# Altium schematic sheet Lora_Com.SchDoc
size 594 x 420 mm; CheckedBy: Трухачев И.; Author: Денисов В.; SheetNumber: 1; PageSetup: Record=PageOptions|CenterHorizontal=True|CenterVertical=True|PrintScale=0.94|XCorrection=1.00|YCorrection=1.00|PrintKind=1|BorderSize=5000000|LeftOffset=0|BottomOffset=0|Orientation=1|PaperLength=1000|PaperWidth=1000|Scale=100|PaperSource=7|PrintQuality=-4|MediaType=1|DitherType=10|PaperKind=A4|PrintScaleMode=1; DecimalNumber: ГРКЕ.464421.034 Э3; HeadOfSector: Нач. сектора; MainDevice: Перв.примен.; Name: Изделие-коммуникатор
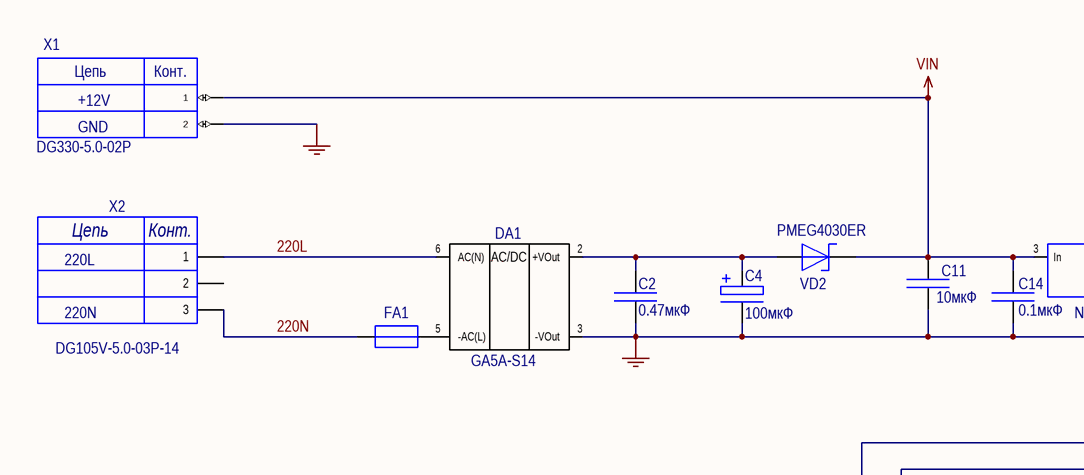
[diagram p0: Lora_Com.SchDoc, top left]
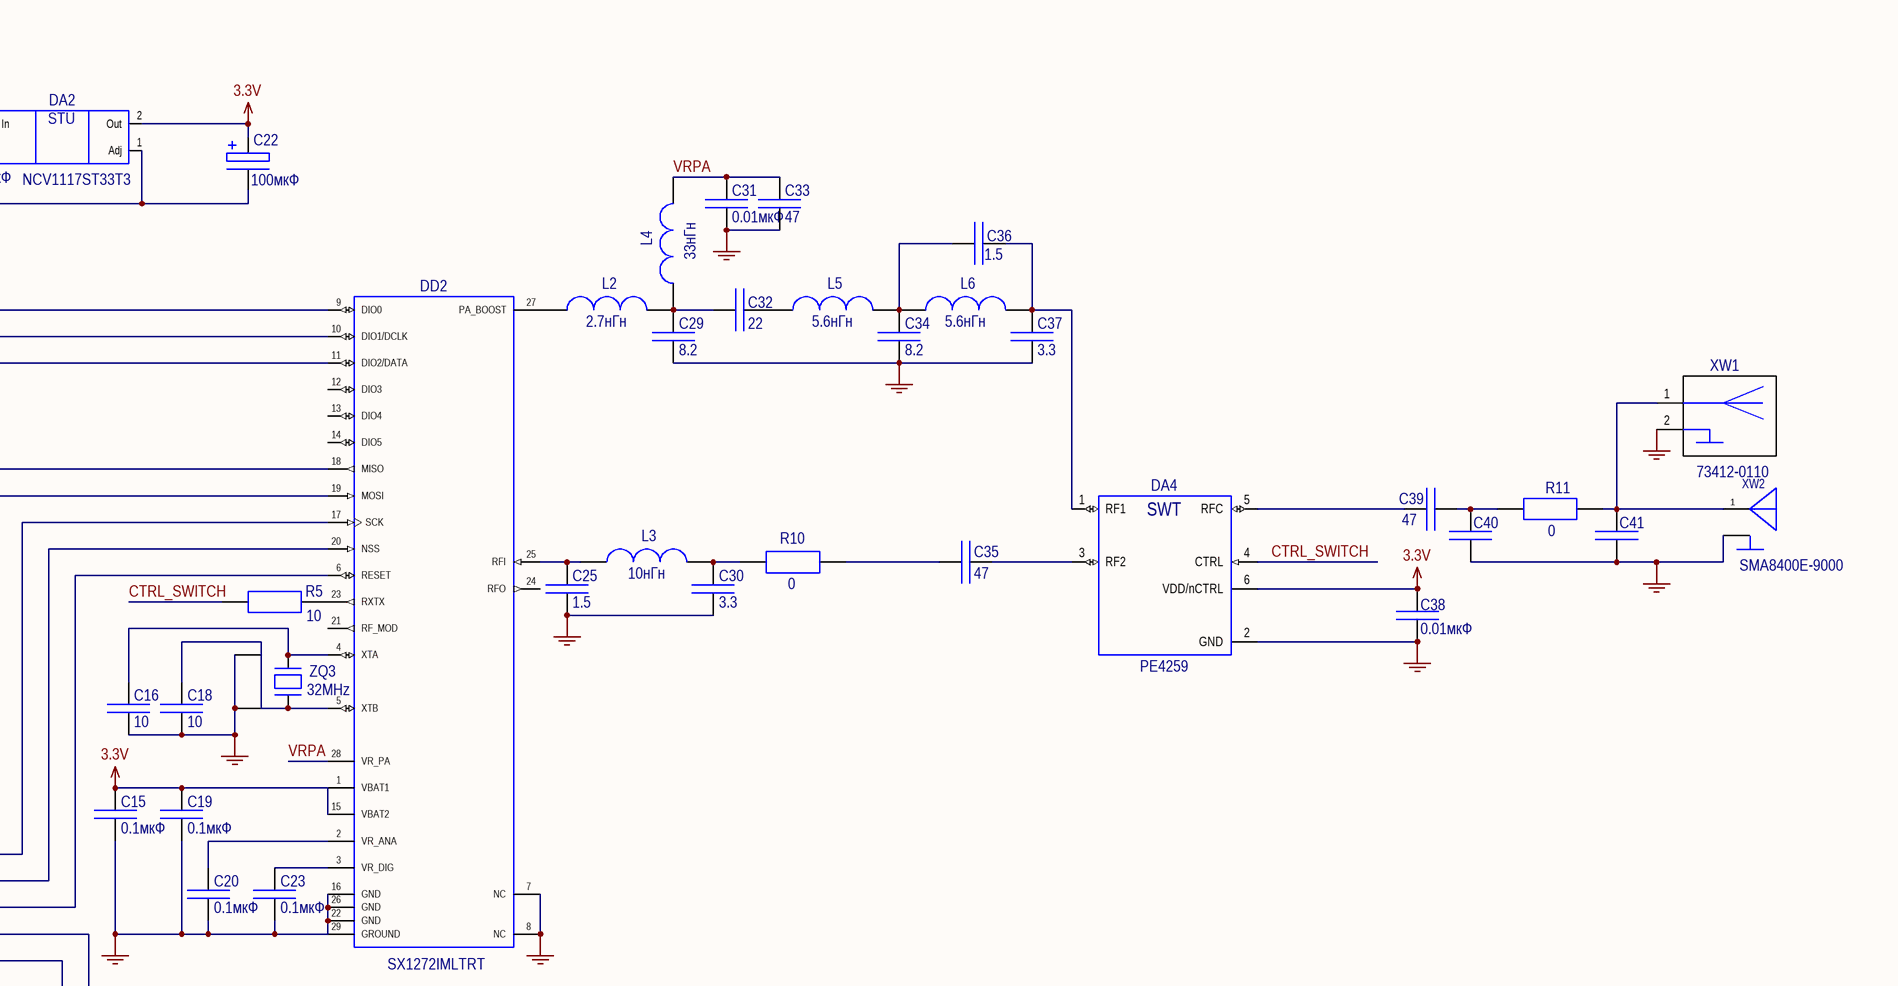
[diagram p1: Lora_Com.SchDoc, top right]
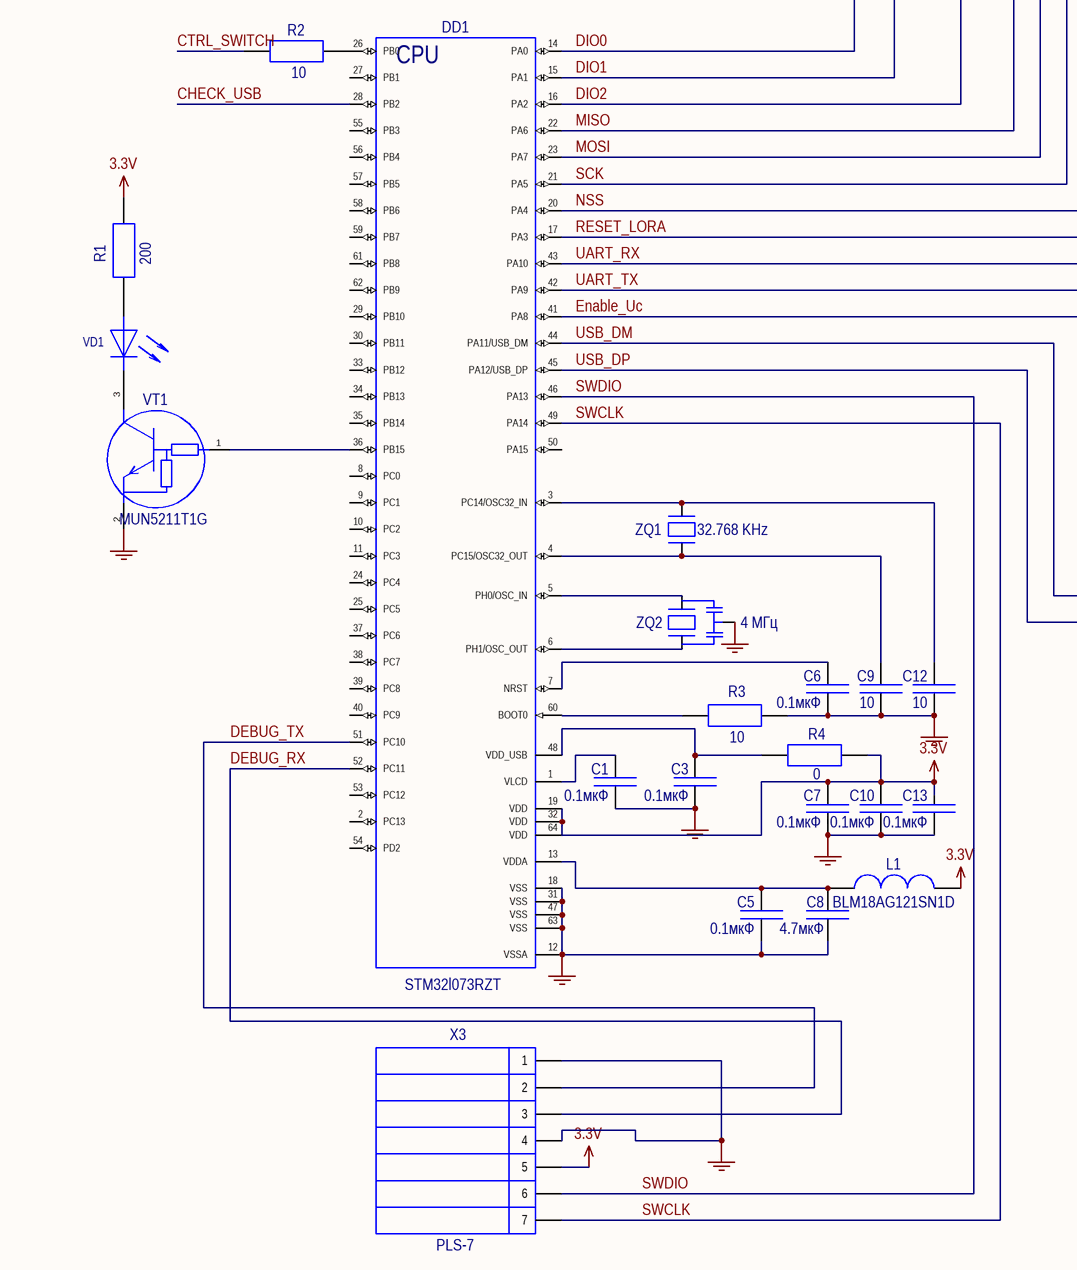
[diagram p2: Lora_Com.SchDoc, bottom left]
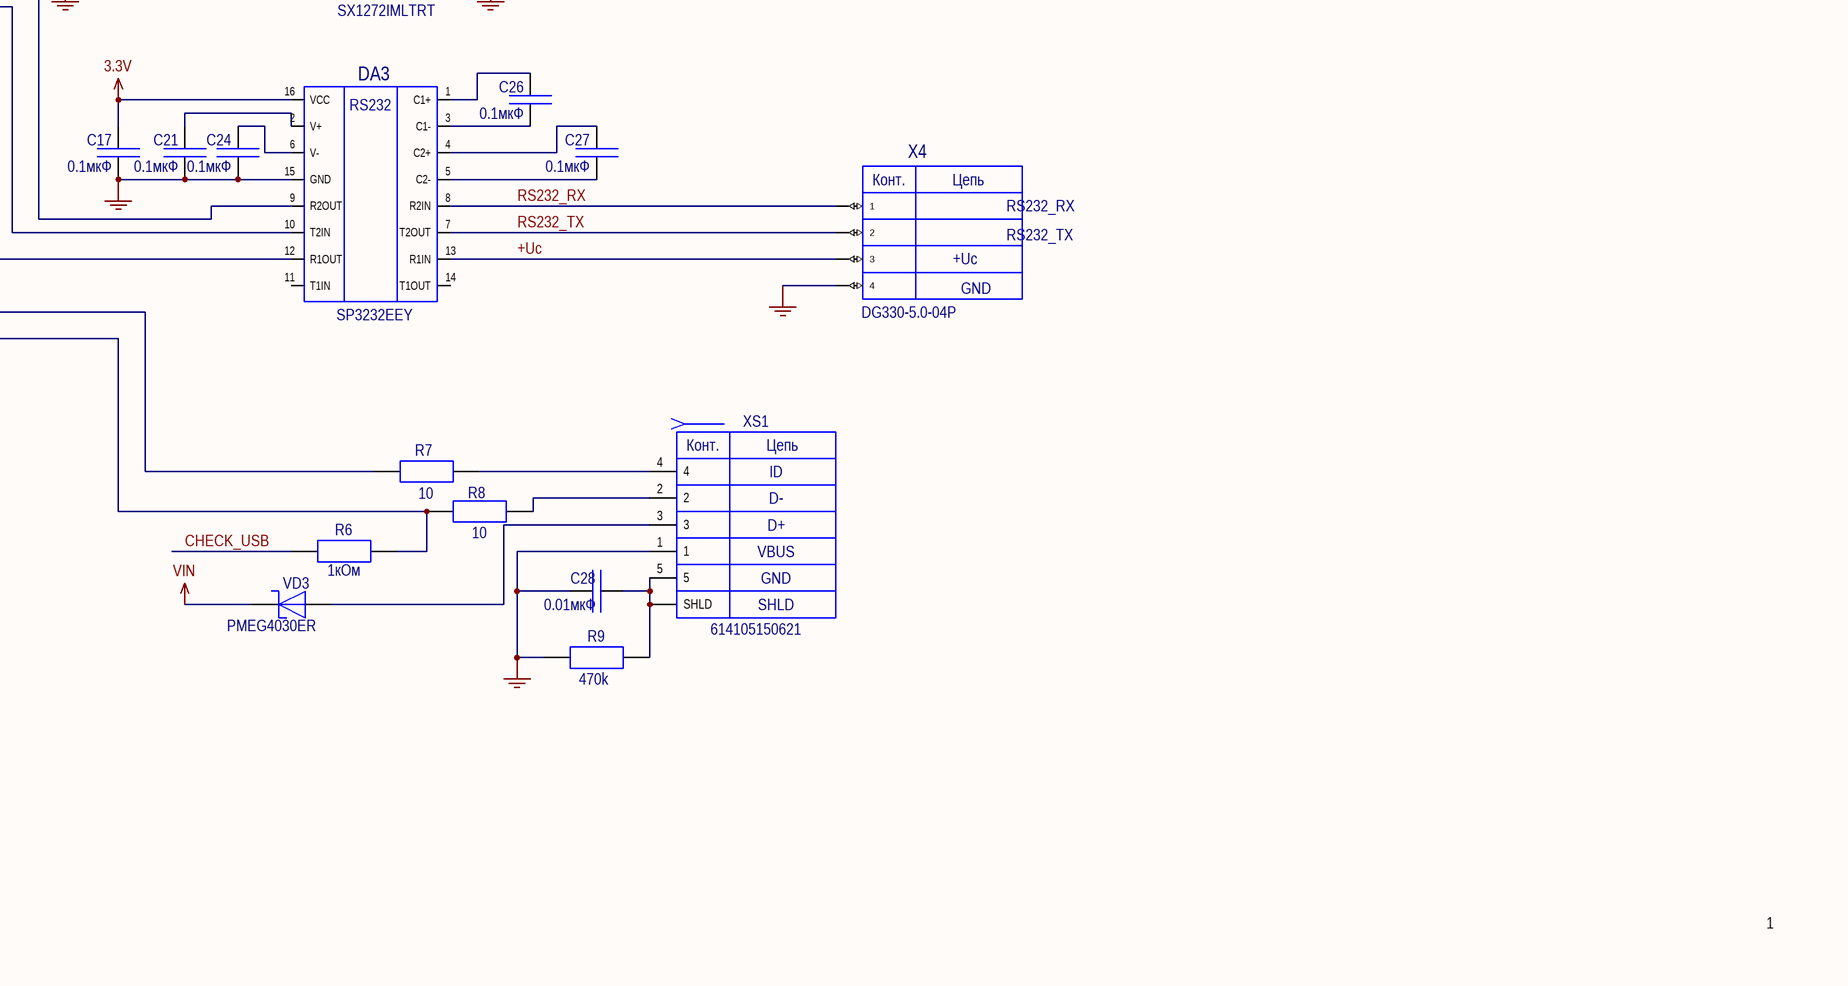
[diagram p3: Lora_Com.SchDoc, bottom right]

## Parts
C1  value 0.1мкФ  [CAPC1005X50(0402)]  (hidden comment: чип 0402 0.1мкФ/10V,)
C2  value 0.47мкФ  [CAPC1608X50(0603)]  (hidden comment: чип 0603 0.47мкФ/25V,)
C3  value 0.1мкФ  [CAPC1005X50(0402)]  (hidden comment: чип 0402 0.1мкФ/10V,)
C4  value 100мкФ  [CAPAE680X570N_(D)]  (hidden comment: Alum. 6.3x5.4 100мкФ/25V)
C5  value 0.1мкФ  [CAPC1005X50(0402)]  (hidden comment: чип 0402 0.1мкФ/10V,)
C6  value 0.1мкФ  [CAPC1005X50(0402)]  (hidden comment: чип 0402 0.1мкФ/10V,)
C7  value 0.1мкФ  [CAPC1005X50(0402)]  (hidden comment: чип 0402 0.1мкФ/10V,)
C8  value 4.7мкФ  [CAPC1608X50(0603)]  (hidden comment: чип 0603 4.7мкФ/50V,)
C9  value 10  [CAPC1005X50(0402)]  (hidden comment: чип 0402 10/10V,)
C10  value 0.1мкФ  [CAPC1005X50(0402)]  (hidden comment: чип 0402 0.1мкФ/10V,)
C11  value 10мкФ  [CAPC3216X135(1206)]  (hidden comment: чип 1206 10мкФ/50V,)
C12  value 10  [CAPC1005X50(0402)]  (hidden comment: чип 0402 10/10V,)
C13  value 0.1мкФ  [CAPC1005X50(0402)]  (hidden comment: чип 0402 0.1мкФ/10V,)
C14  value 0.1мкФ  [CAPC1005X50(0402)]  (hidden comment: чип 0402 0.1мкФ/10V,)
C15  value 0.1мкФ  [CAPC1005X50(0402)]  (hidden comment: чип 0402 0.1мкФ/10V,)
C16  value 10  [CAPC1005X50(0402)]  (hidden comment: чип 0402 10/10V,)
C17  value 0.1мкФ  [CAPC1005X50(0402)]  (hidden comment: чип 0402 0.1мкФ/10V,)
C18  value 10  [CAPC1005X50(0402)]  (hidden comment: чип 0402 10/10V,)
C19  value 0.1мкФ  [CAPC1005X50(0402)]  (hidden comment: чип 0402 0.1мкФ/10V,)
C20  value 0.1мкФ  [CAPC1005X50(0402)]  (hidden comment: чип 0402 0.1мкФ/10V,)
C21  value 0.1мкФ  [CAPC1005X50(0402)]  (hidden comment: чип 0402 0.1мкФ/10V,)
C22  value 100мкФ  [CAPAE680X570N_(D)]  (hidden comment: Alum. 6.3x5.4 100мкФ/6.3V)
C23  value 0.1мкФ  [CAPC1005X50(0402)]  (hidden comment: чип 0402 0.1мкФ/10V,)
C24  value 0.1мкФ  [CAPC1005X50(0402)]  (hidden comment: чип 0402 0.1мкФ/10V,)
C25  value 1.5  [CAPC1005X50(0402)]  (hidden comment: чип 0402 1.5/10V,)
C26  value 0.1мкФ  [CAPC1005X50(0402)]  (hidden comment: чип 0402 0.1мкФ/10V,)
C27  value 0.1мкФ  [CAPC1005X50(0402)]  (hidden comment: чип 0402 0.1мкФ/10V,)
C28  value 0.01мкФ  [CAPC1608X50(0603)]  (hidden comment: чип 0603 0.01мкФ/25V,)
C29  value 8.2  [CAPC1005X50(0402)]  (hidden comment: чип 0402 8.2/10V,)
C30  value 3.3  [CAPC1005X50(0402)]  (hidden comment: чип 0402 3.3/10V,)
C31  value 0.01мкФ  [CAPC1005X50(0402)]  (hidden comment: чип 0402 0.01мкФ/10V,)
C32  value 22  [CAPC1005X50(0402)]  (hidden comment: чип 0402 22/10V,)
C33  value 47  [CAPC1005X50(0402)]  (hidden comment: чип 0402 47/10V,)
C34  value 8.2  [CAPC1005X50(0402)]  (hidden comment: чип 0402 8.2/10V,)
C35  value 47  [CAPC1005X50(0402)]  (hidden comment: чип 0402 47/10V,)
C36  value 1.5  [CAPC1005X50(0402)]  (hidden comment: чип 0402 1.5/10V,)
C37  value 3.3  [CAPC1005X50(0402)]  (hidden comment: чип 0402 3.3/10V,)
C38  value 0.01мкФ  [CAPC1005X50(0402)]  (hidden comment: чип 0402 0.01мкФ/10V,)
C39  value 47  [CAPC1005X50(0402)]  (hidden comment: чип 0402 47/10V,)
C40  чип 0402 NC/10V,  [CAPC1005X50(0402)]  (value not drawn)
C41  чип 0402 NC/10V,  [CAPC1005X50(0402)]  (value not drawn)
DA1  GA5A-S14  [GA5A-S14]
DA2  NCV1117ST33T3  [SOT230P700X180-4N(SOT223)_NUM]
DA3  SP3232EEY  [TSOP65P640X105-16N]
DA4  PE4259  [SOT65P210X110-6N(SOT363)]
DD1  STM32l073RZT  [TSQFP50P1200X1200X160-64N]
DD2  SX1272IMLTRT  [QFN65P600X600X100_HS-29N]
FA1  Fuse 1A/250Vac/63Vdc  [RSTA 1-BULK]  (value not drawn)
L1  BLM18AG121SN1D  [RESC1608X45(0603)]
L2  2.7нГн  [RESC1005X35(0402)]
L3  10нГн  [RESC1005X35(0402)]
L4  33нГн  [RESC1005X35(0402)]
L5  5.6нГн  [RESC1005X35(0402)]
L6  5.6нГн  [RESC1005X35(0402)]
R1  value 200  [RESC1608X45(0603)]  (hidden comment: чип 0603 200 5%)
R2  value 10  [RESC1608X45(0603)]  (hidden comment: чип 0603 10 5%)
R3  value 10  [RESC1608X45(0603)]  (hidden comment: чип 0603 10 5%)
R4  value 0  [RESC1608X45(0603)]  (hidden comment: чип 0603 0 5%)
R5  value 10  [RESC1608X45(0603)]  (hidden comment: чип 0603 10 5%)
R6  value 1кОм  [RESC1608X45(0603)]  (hidden comment: чип 0603 1кОм 5%)
R7  value 10  [RESC1608X45(0603)]  (hidden comment: чип 0603 10 5%)
R8  value 10  [RESC1608X45(0603)]  (hidden comment: чип 0603 10 5%)
R9  value 470k  [RESC1608X45(0603)]  (hidden comment: чип 0603 470k 5%)
R10  value 0  [RESC1005X35(0402)]  (hidden comment: чип 0402 0 5%)
R11  value 0  [RESC1005X35(0402)]  (hidden comment: чип 0402 0 5%)
VD1  чип 0603 LED (RED)  [LEDC1608X80N(0603)_red]  (value not drawn)
VD2  PMEG4030ER  [SOD3718X135N(SOD123FL)]
VD3  PMEG4030ER  [SOD3718X135N(SOD123FL)]
VT1  MUN5211T1G  [SOT65P200X110-3N (SOT323)_NUM]
X1  DG330-5.0-02P  [DG330-5.0-02P]
X2  DG105V-5.0-03P-14  [DG105V-5.0-03P-14]
X3  PLS-7  [HEADER1-7P2.54]
X4  DG330-5.0-04P  [DG330-5.0-04P]
XS1  614105150621  [USB Micro TH 614105150621]
XW1  73412-0110  [73412-0110]
XW2  SMA8400E-9000  [CH80-20]
ZQ1  value 32.768 KHz  [XTAL320X150X90-2N(DST)]  (hidden comment: DST310S(32.768 KHz))
ZQ2  value 4 МГц  [XTAL320X130X120 (CSTCE_G15C)]  (hidden comment: CSTCE8M00G52A-R0(4 МГц))
ZQ3  value 32MHz  [XTAL320X250X78-4N(ADM8)]  (hidden comment: KX-7T-12.88662 12MHz(32MHz))

## Nets
3.3V: C7.2(P2) C10.2(P2) C13.2(P2) C15.2(P2) C17.2(P2) C19.2(P2) C22.1(P1) C38.1(P1) DA2.2(Out) DA3.16(VCC) DA4.6(VDD/nCTRL) DD1.19(VDD) DD1.32(VDD) DD1.64(VDD) DD2.1(VBAT1) DD2.15(VBAT2) L1.1 R1.1 R4.1 X3.5
GND: C1.1(P1) C2.1 C3.1(P1) C4.2(P2) C5.1(P1) C6.1(P1) C7.1(P1) C8.1 C9.1(P1) C10.1(P1) C11.2 C12.1(P1) C13.1(P1) C14.1(P1) C15.1(P1) C16.1(P1) C17.1(P1) C18.1(P1) C19.1(P1) C20.1(P1) C21.1(P1) C22.2(P2) C23.1(P1) C24.1(P1) C25.1(P1) C28.2 C29.1(P1) C30.1(P1) C31.1(P1) C33.1(P1) C34.1(P1) C37.1(P1) C38.2(P2) C40.2(P2) C41.2(P2) DA1.3(-VOut) DA2.1(Adj) DA3.15(GND) DA4.2(GND) DD1.12(VSSA) DD1.18(VSS) DD1.31(VSS) DD1.47(VSS) DD1.63(VSS) DD2.7(NC) DD2.8(NC) DD2.16(GND) DD2.22(GND) DD2.26(GND) DD2.29(GROUND) R3.1 R9.2 VT1.2(E) X1.2 X3.1 X3.4 X4.4 XS1.1 XW1.2(GND) XW2.2 ZQ2.2 ZQ3.2 ZQ3.4
VIN: C11.1 C14.2(P2) DA2.3(In) VD2.C VD3.C X1.1
220L: DA1.6(AC(N)) X2.1
220N: FA1.1 X2.3
+Uc: DA3.13(R1IN) X4.3
CHECK_USB: DD1.28(PB2) R6.1
CTRL_SWITCH: DA4.4(CTRL) R2.1 R5.1
DEBUG_RX: DD1.52(PC11) X3.3
DEBUG_TX: DD1.51(PC10) X3.2
DIO0: DD1.14(PA0) DD2.9(DIO0)
DIO1: DD1.15(PA1) DD2.10(DIO1/DCLK)
DIO2: DD1.16(PA2) DD2.11(DIO2/DATA)
Enable_Uc: DA3.12(R1OUT) DD1.41(PA8)
MISO: DD1.22(PA6) DD2.18(MISO)
MOSI: DD1.23(PA7) DD2.19(MOSI)
NSS: DD1.20(PA4) DD2.20(NSS)
RESET_LORA: DD1.17(PA3) DD2.6(RESET)
RS232_RX: DA3.8(R2IN) X4.1
RS232_TX: DA3.7(T2OUT) X4.2
SCK: DD1.21(PA5) DD2.17(SCK)
SWCLK: DD1.49(PA14) X3.7
SWDIO: DD1.46(PA13) X3.6
UART_RX: DA3.9(R2OUT) DD1.43(PA10)
UART_TX: DA3.10(T2IN) DD1.42(PA9)
USB_DM: DD1.44(PA11/USB_DM) R7.1
USB_DP: DD1.45(PA12/USB_DP) R6.2 R8.1
VRPA: C31.2(P2) C33.2(P2) DD2.28(VR_PA) L4.2
NetC1_2: C1.2(P2) DD1.1(VLCD)
NetC2_2: C2.2 C4.1(P1) DA1.2(+VOut) VD2.A
NetC3_2: C3.2(P2) DD1.48(VDD_USB) R4.2
NetC5_2: C5.2(P2) C8.2 DD1.13(VDDA) L1.2
NetC6_2: C6.2(P2) DD1.7(NRST)
NetC9_2: C9.2(P2) DD1.4(PC15/OSC32_OUT) ZQ1.1
NetC12_2: C12.2(P2) DD1.3(PC14/OSC32_IN) ZQ1.2
NetC16_2: C16.2(P2) DD2.4(XTA) ZQ3.1
NetC18_2: C18.2(P2) DD2.5(XTB) ZQ3.3
NetC20_2: C20.2(P2) DD2.2(VR_ANA)
NetC21_2: C21.2(P2) DA3.2(V+)
NetC23_2: C23.2(P2) DD2.3(VR_DIG)
NetC24_2: C24.2(P2) DA3.6(V-)
NetC25_2: C25.2(P2) DD2.25(RFI) L3.1
NetC26_1: C26.1(P1) DA3.3(C1-)
NetC26_2: C26.2(P2) DA3.1(C1+)
NetC27_1: C27.1(P1) DA3.5(C2-)
NetC27_2: C27.2(P2) DA3.4(C2+)
NetC28_1: C28.1 R9.1 XS1.5 XS1.SHLD
NetC29_2: C29.2(P2) C32.2(P2) L2.2 L4.1
NetC30_2: C30.2(P2) L3.2 R10.1
NetC32_1: C32.1(P1) L5.1
NetC34_2: C34.2(P2) C36.2(P2) L5.2 L6.1
NetC35_1: C35.1(P1) DA4.3(RF2)
NetC35_2: C35.2(P2) R10.2
NetC36_1: C36.1(P1) C37.2(P2) DA4.1(RF1) L6.2
NetC39_1: C39.1(P1) C40.1(P1) R11.1
NetC39_2: C39.2(P2) DA4.5(RFC)
NetC41_1: C41.1(P1) R11.2 XW1.1 XW2.1
NetDA1_5: DA1.5(-AC(L)) FA1.2
NetDD1_5: DD1.5(PH0/OSC_IN) ZQ2.1
NetDD1_6: DD1.6(PH1/OSC_OUT) ZQ2.3
NetDD1_26: DD1.26(PB0) R2.2
NetDD1_36: DD1.36(PB15) VT1.1(B)
NetDD1_60: DD1.60(BOOT0) R3.2
NetDD2_23: DD2.23(RXTX) R5.2
NetDD2_27: DD2.27(PA_BOOST) L2.1
NetR1_2: R1.2 VD1.A(anod)
NetR7_2: R7.2 XS1.4
NetR8_2: R8.2 XS1.2
NetVD1_C: VD1.C(cathode) VT1.3(C)
NetVD3_A: VD3.A XS1.3

Not connected (* = marked no-connect by the designer): DA3 11(T1IN) 14(T1OUT); DD1 2(PC13) 8(PC0) 9(PC1) 10(PC2) 11(PC3) 24(PC4) 25(PC5) 27(PB1) 29(PB10) 30(PB11) 33(PB12) 34(PB13) 35(PB14) 37(PC6) 38(PC7) 39(PC8) 40(PC9) 50(PA15) 53(PC12) 54(PD2) 55(PB3) 56(PB4) 57(PB5) 58(PB6) 59(PB7) 61(PB8) 62(PB9); DD2 12(DIO3) 13(DIO4) 14(DIO5) 21(RF_MOD) 24(RFO); X2 2

## Notes on the sheet
- +12V
- GND
- 220L
- 220N
- RS232_RX
- RS232_TX
- +Uc
- 1
- Перв.примен.
- Справ.№
- Подп. и дата
- Инв.№ дубл.
- Взам.инв.№
- Подп.и дата
- Разраб.
- Изм.
- Лист
- № докум.
- Подп.
- Дата
- Лит.
- Масса
- Масштаб
- Т.контр.
- Пров.
- СХЕМА   ЭЛЕКТРИЧЕСКАЯ
- ПРИНЦИПИАЛЬНАЯ
- Листов
- Инв.№ подл.
- Утв.
- Н.контр.
- Нач.сект.
- Формат  A2
- (in symbol AC-DC) AC/DC
- (in symbol DG105V-5.0-03P-14) Цепь; Конт.
- (in symbol DG330-5.0-02P-12-00A) Цепь; Конт.
- (in symbol DG330-5.0-04P-12-00A) Конт.; Цепь
- (in symbol NCV1117ST33T3) STU
- (in symbol PE4259) SWT
- (in symbol SP3232EEY) RS232
- (in symbol STM32l073RZT) CPU
- (in symbol USB TH Micro 614105150621) Конт.; Цепь; ID; D-; D+; VBUS; GND

## Library data of the parts
C1 C10 C14 = C0402: cmpPartNum: CC0402KRX7R8BB104; cmpDescription: чип 0402 0.1мкФ , 10V, , CC0402KRX7R8BB104; parVoltage: 10V; Category: Конденсатор; cmpPkg: чип 0402
C2 = C0603: cmpPartNum: GRM188R60J475KE19D; cmpDescription: чип 0603 0.47мкФ , 25V, , GRM188R60J475KE19D; parVoltage: 25V; Category: Конденсатор; cmpPkg: чип 0603
C3 C5-C7 C13 C15 C17 C19-C21 C23 C24 C26 C27 = C0402: cmpDescription: чип 0402 0.1мкФ , 10V, ,; parVoltage: 10V; Category: Конденсатор; cmpPkg: чип 0402
C4 = Alum. size D: Alum. size D (o6.3x5.4L (mm)); cmpDescription: , Alum. 6.3x5.4, 100мкФ , 25V; parVoltage: 25V; Category: Конденсатор; cmpPkg: Alum. 6.3x5.4
C8 = C0603: cmpPartNum: GRM188R60J475KE19D; cmpDescription: чип 0603 4.7мкФ , 50V, , GRM188R60J475KE19D; parVoltage: 50V; Category: Конденсатор; cmpPkg: чип 0603
C9 C12 C16 C18 = C0402: cmpDescription: чип 0402 10 , 10V, ,; parVoltage: 10V; Category: Конденсатор; cmpPkg: чип 0402
C11 = C1206: cmpDescription: чип 1206 10мкФ *, 50V, ,; parVoltage: 50V; Tolerance: *; Category: Конденсатор; Примечание: *; cmpPkg: чип 1206
C22 = Alum. size D: Alum. size D (o6.3x5.4L (mm)); cmpDescription: , Alum. 6.3x5.4, 100мкФ , 6.3V; parVoltage: 6.3V; Category: Конденсатор; cmpPkg: Alum. 6.3x5.4
C25 = C0402: cmpPartNum: NONE; cmpDescription: чип 0402 1.5 , 10V, , NONE; parVoltage: 10V; Category: Конденсатор; cmpPkg: чип 0402
C28 = C0603: cmpDescription: чип 0603 0.01мкФ , 25V, ,; parVoltage: 25V; Category: Конденсатор; cmpPkg: чип 0603
C29 C34 = C0402: cmpPartNum: GRM1555C1H8R2CZ01D; cmpDescription: чип 0402 8.2 , 10V, , GRM1555C1H8R2CZ01D; parVoltage: 10V; Category: Конденсатор; cmpPkg: чип 0402
C30 C37 = C0402: cmpPartNum: GRM1555C1H3R3CZ01D; cmpDescription: чип 0402 3.3 , 10V, , GRM1555C1H3R3CZ01D; parVoltage: 10V; Category: Конденсатор; cmpPkg: чип 0402
C31 = C0402: cmpPartNum: GRM155R71E103KA01D; cmpDescription: чип 0402 0.01мкФ , 10V, , GRM155R71E103KA01D; parVoltage: 10V; Category: Конденсатор; cmpPkg: чип 0402
C32 = C0402: cmpPartNum: GRM1555C1H220JZ01D; cmpDescription: чип 0402 22 , 10V, , GRM1555C1H220JZ01D; parVoltage: 10V; Category: Конденсатор; cmpPkg: чип 0402
C33 C35 C39 = C0402: cmpPartNum: GRM1555C1H470JZ01D; cmpDescription: чип 0402 47 , 10V, , GRM1555C1H470JZ01D; parVoltage: 10V; Category: Конденсатор; cmpPkg: чип 0402
C36 = C0402: cmpPartNum: GRM1555C1H1R5CZ01D; cmpDescription: чип 0402 1.5 , 10V, , GRM1555C1H1R5CZ01D; parVoltage: 10V; Category: Конденсатор; cmpPkg: чип 0402
C38 = C0402: cmpPartNum: GRM155R71H102JA01D; cmpDescription: чип 0402 0.01мкФ , 10V, , GRM155R71H102JA01D; parVoltage: 10V; Category: Конденсатор; cmpPkg: чип 0402
C40 C41 = C0402: cmpDescription: чип 0402 NC , 10V, ,; parVoltage: 10V; Value: NC; Category: Конденсатор; cmpPkg: чип 0402
DA1 = AC-DC
DA4 = PE4259: SOT363 RF Switch IC General Purpose SPDT 50 Ohm; cmpManufacturer: Peregrine; cmpPkg: SOT-363; parBandwidth: 3 GHz; cmpDescription: Peregrine PE4259 (SOT-363); cmpPartNum: PE4259; Category: Микросхема
DD1 = STM32l073RZT: LQFP-64 Ultra-low-power 32-bit MCU ARM®-based Cortex®-M0+, up to 192KB  Flash, 20KB SRAM, 6KB EEPROM, LCD, USB, ADC, DACs; cmpManufacturer: ST; parOTemp: -40°C to 85°C; cmpDescription: ST STM32l073RZT (LQFP-64); Value: *; Category: Микросхема; cmpPkg: LQFP-64; cmpPartNum: STM32l073RZT
DD2 = SX1272IMLTRT: SX1272/73 - 860 MHz to 1020 MHz Low Power Long Range Transceiver; cmpManufacturer: Semtech; cmpPkg: QFN-28; parOTemp: -40°C to 85°C; cmpDescription: Semtech SX1272IMLTRT (QFN-28); Category: Микросхема; cmpPartNum: SX1272IMLTRT
FA1 = FUSE RSTA: Time Lag Radial Lead Micro Fuse Series; cmpPartNum: MF-LSMF185/33X; cmpManufacturer: Bel Fuse inc.; cmpDescription: MF-LSMF185/33X, Предохранитель Radial, Box 1A, 250Vac/63Vdc; cmpPkg: Radial, Box; parCurrent: 1A; Category: Предохранитель; Примечание: *; Tolerance: *; parVoltage: 250Vac/63Vdc
L1 = L0603: Chip coil 0603; cmpDescription: , чип 0603 BLM18AG121SN1D , ,; cmpPkg: чип 0603; Category: Дроссель; Value: BLM18AG121SN1D
L2 = L0402: Chip coil 0402; cmpPartNum: LQW15AN2N7D00D; cmpDescription: LQW15AN2N7D00D, чип 0402 2.7нГн , ,; cmpPkg: чип 0402; Category: Дроссель; Value: 2.7нГн
L3 = L0402: Chip coil 0402; cmpPartNum: LQG15HS10NJ02D; cmpDescription: LQG15HS10NJ02D, чип 0402 10нГн , ,; cmpPkg: чип 0402; Category: Дроссель; Value: 10нГн
L4 = L0402: Chip coil 0402; cmpPartNum: LQW15AN33NJ00D; cmpDescription: LQW15AN33NJ00D, чип 0402 33нГн , ,; cmpPkg: чип 0402; Category: Дроссель; Value: 33нГн
L5 L6 = L0402: Chip coil 0402; cmpPartNum: LQW15AN5N6C10D; cmpDescription: LQW15AN5N6C10D, чип 0402 5.6нГн , ,; cmpPkg: чип 0402; Category: Дроссель; Value: 5.6нГн
R1 = R0603: cmpDescription: чип 0603 200 5%, 100 мВт, ,; parPwr: 100 мВт; Category: Резистор; cmpPkg: чип 0603; Tolerance: 5%
R2 R3 R5 R7 R8 = R0603: cmpDescription: чип 0603 10 5%, 100 мВт, ,; parPwr: 100 мВт; Category: Резистор; cmpPkg: чип 0603; Tolerance: 5%
R4 = R0603: cmpDescription: чип 0603 0 5%, 100 мВт, ,; parPwr: 100 мВт; Category: Резистор; cmpPkg: чип 0603; Tolerance: 5%
R6 = R0603: cmpDescription: чип 0603 1кОм 5%, 100 мВт, ,; parPwr: 100 мВт; Category: Резистор; cmpPkg: чип 0603; Tolerance: 5%
R9 = R0603: cmpDescription: чип 0603 470k 5%, 100 мВт, ,; parPwr: 100 мВт; Category: Резистор; cmpPkg: чип 0603; Tolerance: 5%
R10 R11 = R0402: cmpPartNum: CRCW04020000Z0ED; cmpDescription: чип 0402 0 5%, 62 мВт, , CRCW04020000Z0ED; parPwr: 62 мВт; Category: Резистор; cmpPkg: чип 0402; Tolerance: 5%
VD1 = LED 0603: cmpDescription: LED 0603, LED RED, чип 0603; parLvTyp: xxмкд; parPd: ххмВт; parVf: хВ; Примечание: *; Category: Диод; cmpPkg: чип 0603; cmpPartNum: LED 0603; parColor: RED; cmpType: LED
VD2 VD3 = SOD123 SHOTCKY: MBR2H100SFT3G; cmpPkg: SOD123FL; parFCurrent: 3А; parPwr: хххмВт; parVoltage: 40В; cmpType: Schottky; cmpDescription: PMEG4030ER, Schottky, 3А, 40В, SOD123FL; Category: Диод; cmpPartNum: PMEG4030ER
VT1 = MUN5211T1G: MUN5211T1; cmpManufacturer: ON Semiconductor; Title: Транзистор; cmpPkg: SOT-323; parHfe: 35-60; parOTemp: -55°C to 150°C; parCurrent: 0.1А; parVce: 50В; cmpType: NPN General; parR1value: 10К; Category: Транзистор; cmpPartNum: MUN5211T1G; cmpDescription: =cmpPartNum+' '+cmpType+' '+parType+' '+cmpPkg; parR2value: 10К
X1 = DG330-5.0-02P-12-00A
X2 = DG105V-5.0-03P-14: cmpManufacturer: Degson; parType: Vertical; cmpDescription: Degson DG105V-5.0-03P-14, Terminal Connector, Vertical; parOtemp: -40°C to +105°C; cmpType: Terminal Connector; Category: Разъем; cmpPartNum: DG105V-5.0-03P-14
X3 = PLS-7: Pin Header Single Row 7 pins; cmpCategory: Industrial; cmpDescription: pitch, pins,; Value: *; Category: Разъем
X4 = DG330-5.0-04P-12-00A
XS1 = USB TH Micro 614105150621: Wurth USB - micro AB USB 2.0 Receptacle Connector 5 Position Through Hole; cmpManufacturer: WE; parType: Vertical TH; cmpDescription: WE 614105150621 USB-micro AB, Vertical TH; Category: Разъем; cmpPartNum: 614105150621; cmpType: USB-micro AB
XW1 = 73412-0110: Micro coaxial connector receptacle vertical; cmpManufacturer: Molex; cmpCategory: Industrial; parOtemp: -40°C to 90°C; cmpPkg: SMD; parZ: 50 Ом; cmpDescription: Molex 73412-0110, SMD Vertical, 50 Ом, -40°C to 90°C; Category: Разъем; cmpPartNum: 73412-0110; parType: Vertical
XW2 = SMA Jack RA: SMA Jack Right Angle; cmpManufacturer: Jyebao; cmpCategory: Industrial; cmpDescription: Jyebao SMA8400E-9000, SMA TH Right Angle, 50 Ом,; cmpPkg: SMA TH; parZ: 50 Ом; Category: Антенна; cmpPartNum: SMA8400E-9000; parType: Right Angle
ZQ1 = XTAL, SMD, 3.2mm x 1.5mm, 2 pads: DST310S; cmpManufacturer: Daishinku Corporation; cmpPkg: SMD, 3.2x1.5 mm; parOTemp: -40°C to 85°C; cmpDescription: Кварцевый Резонатор Daishinku Corporation DST310S, (32.768 KHz), 9pF, SMD, 3.2x1.5 mm,  pads, -40°C to 85°C; parCload: 9pF; Category: Кварцевый Резонатор; cmpPartNum: DST310S
ZQ2 = XTAL, SMD, 3.2mm x 1.3mm, 3 pads: CSTCE_G CERALOCK Ceramic Resonators; cmpManufacturer: Murata; cmpPkg: SMD, 3.2x1.3 mm; Tolerance: ±0.5%; parCl: BuiltIN cap; cmpDescription: Murata CSTCE8M00G52A-R0, (4 МГц±0.5%), BuiltIN cap; parOTemp: -40°C to 125°C; cmpPinCount: 3; Category: Кварцевый Резонатор; cmpPartNum: CSTCE8M00G52A-R0
ZQ3 = XTAL, SMD, 3.2mm x 2.5mm, 4 pads: KX-7T series; cmpManufacturer: Geyer; cmpDescription: Geyer KX-7T-12.88662 12MHz, (32MHz±100 ppm), 12pF; cmpPkg: SMD, 3.2x2.5 mm; parOTemp: -40°C to 85°C; Tolerance: ±100 ppm; parCl: 12pF; Category: Кварцевый Резонатор; cmpPartNum: KX-7T-12.88662 12MHz